# Altium schematic sheet PIC32MZ.SchDoc
size A3; SheetNumber: 3; SheetTotal: 8
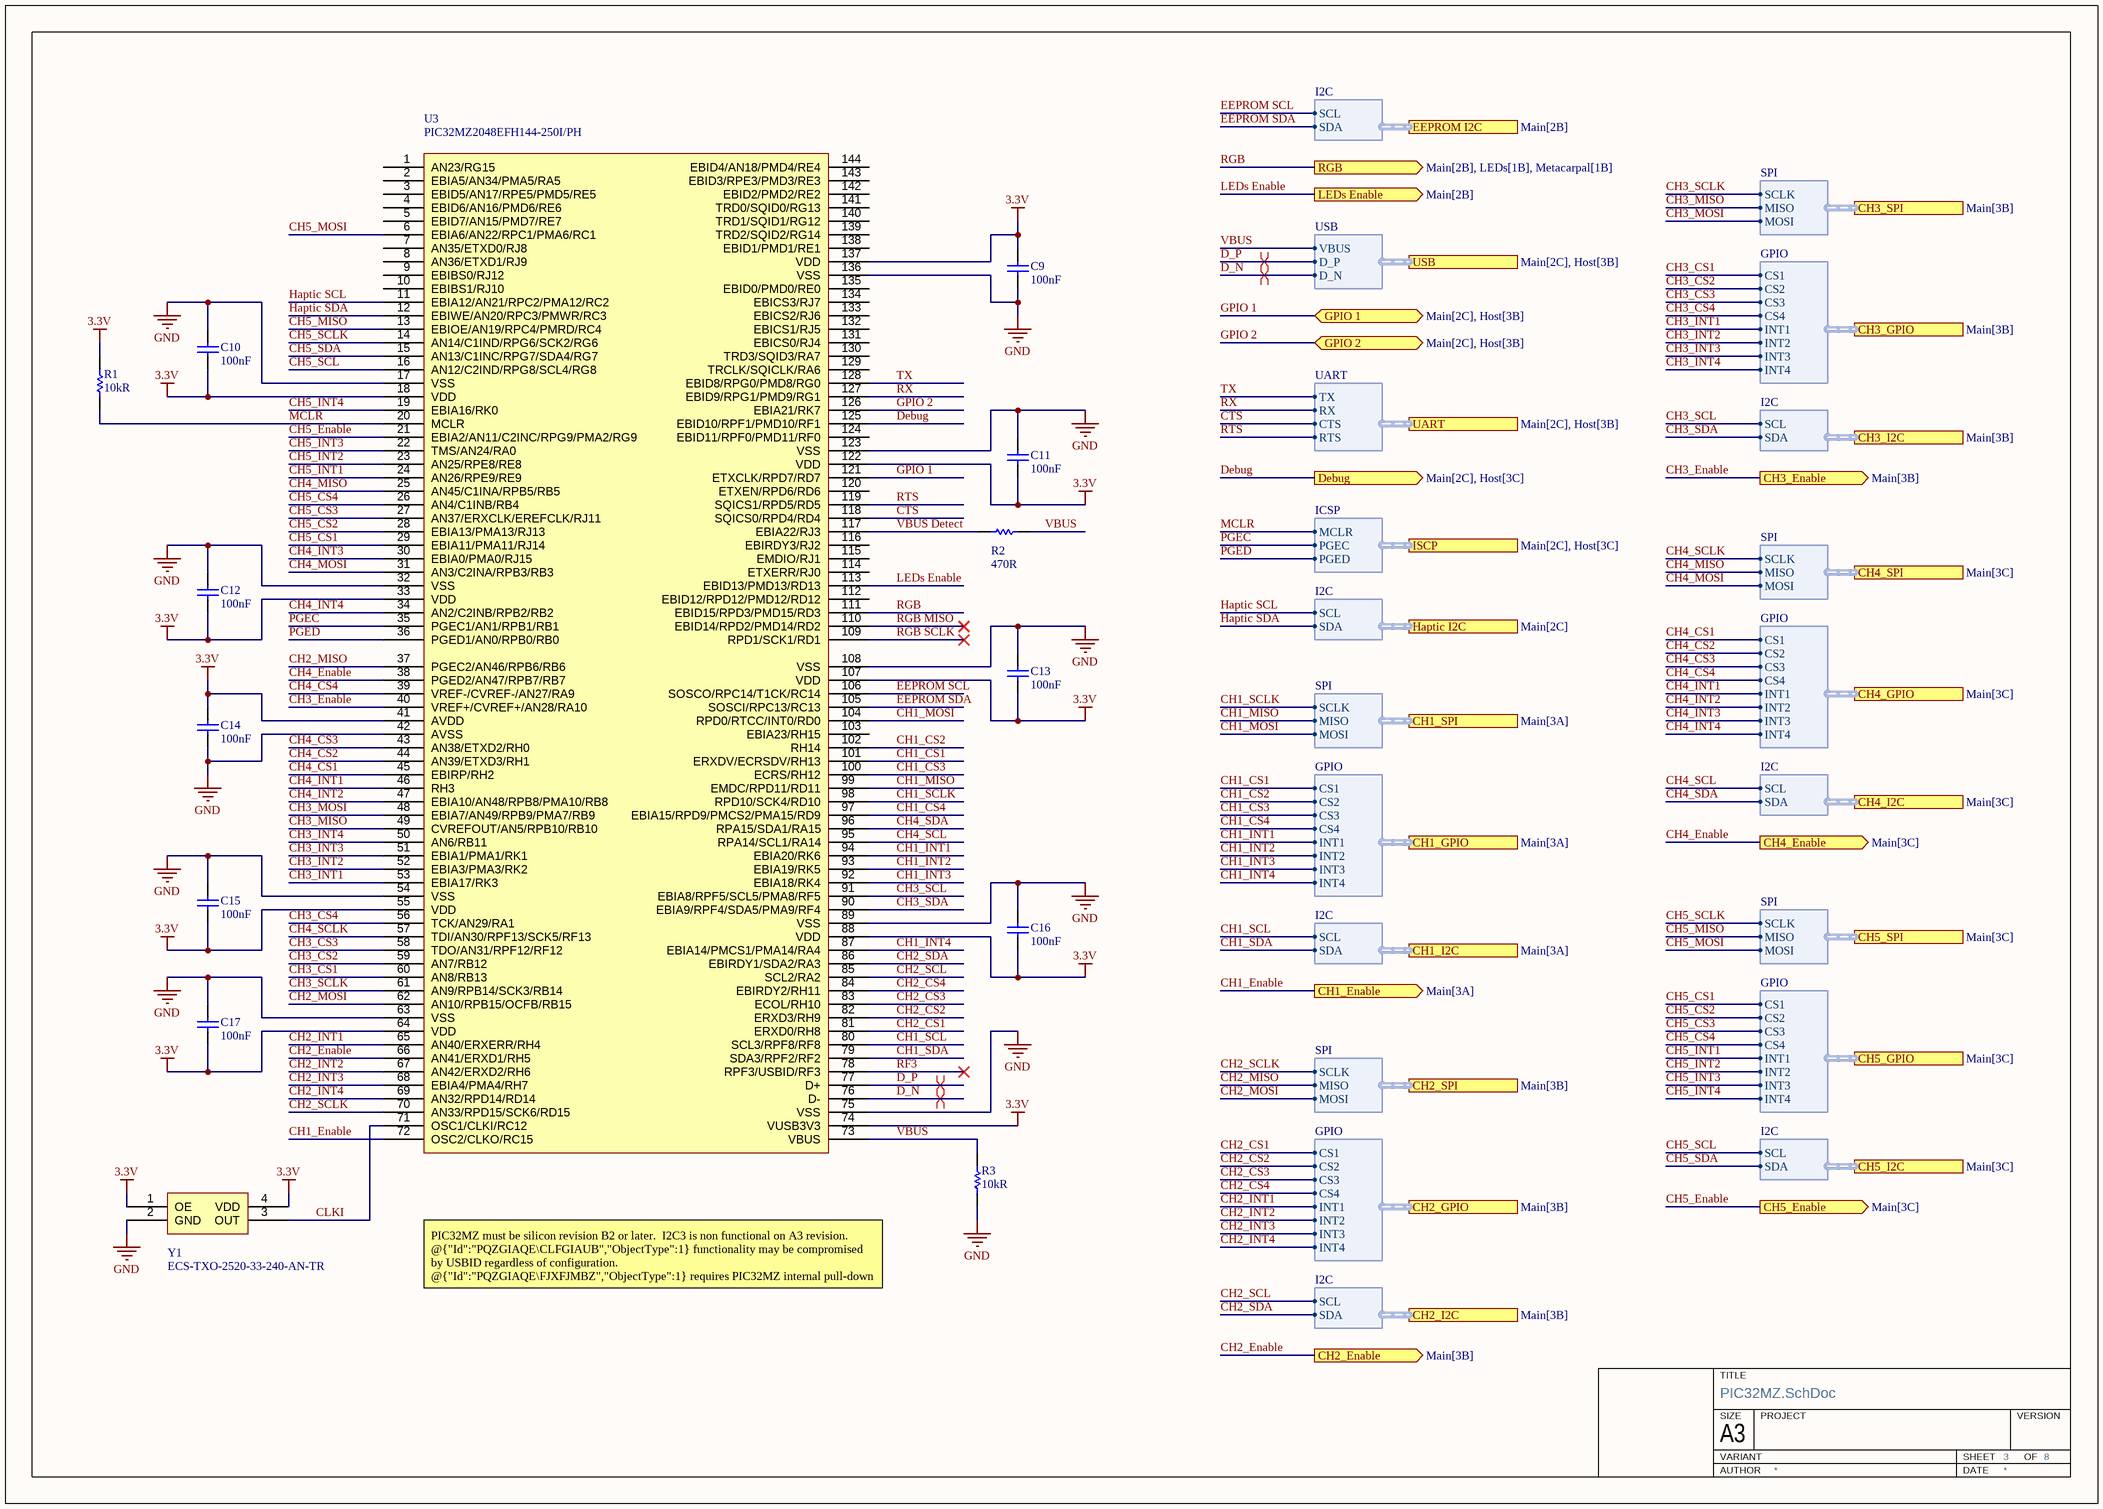
[diagram p0: PIC32MZ.SchDoc]

## Parts
C9  100nF  [Capacitor 0402]
C10  100nF  [Capacitor 0402]
C11  100nF  [Capacitor 0402]
C12  100nF  [Capacitor 0402]
C13  100nF  [Capacitor 0402]
C14  100nF  [Capacitor 0402]
C15  100nF  [Capacitor 0402]
C16  100nF  [Capacitor 0402]
C17  100nF  [Capacitor 0402]
R1  10kR  [Resistor 0402]
R2  470R  [Resistor 0402]
R3  10kR  [Resistor 0402]
U3  PIC32MZ2048EFH144-250I/PH  [TQFP-144 0.4mm]
Y1  ECS-TXO-2520-33-240-AN-TR  [ECS 2x2.5mm]

## Ports
CH1_Enable (out, see Main[3A]), CH1_GPIO (harness GPIO, see Main[3A]), CH1_I2C (harness I2C, see Main[3A]), CH1_SPI (harness SPI, see Main[3A]), CH2_Enable (out, see Main[3B]), CH2_GPIO (harness GPIO, see Main[3B]), CH2_I2C (harness I2C, see Main[3B]), CH2_SPI (harness SPI, see Main[3B]), CH3_Enable (out, see Main[3B]), CH3_GPIO (harness GPIO, see Main[3B]), CH3_I2C (harness I2C, see Main[3B]), CH3_SPI (harness SPI, see Main[3B]), CH4_Enable (out, see Main[3C]), CH4_GPIO (harness GPIO, see Main[3C]), CH4_I2C (harness I2C, see Main[3C]), CH4_SPI (harness SPI, see Main[3C]), CH5_Enable (out, see Main[3C]), CH5_GPIO (harness GPIO, see Main[3C]), CH5_I2C (harness I2C, see Main[3C]), CH5_SPI (harness SPI, see Main[3C]), Debug (out, see Main[2C], Host[3C]), EEPROM I2C (harness I2C, see Main[2B]), GPIO 1 (bidir, see Main[2C], Host[3B]), GPIO 2 (bidir, see Main[2C], Host[3B]), Haptic I2C (harness I2C, see Main[2C]), ISCP (harness ICSP, see Main[2C], Host[3C]), LEDs Enable (out, see Main[2B]), RGB (out, see Main[2B], LEDs[1B], Metacarpal[1B]), UART (harness UART, see Main[2C], Host[3B]), USB (harness USB, see Main[2C], Host[3B])

## Harnesses
I2C: SCL, SDA
SPI: SCLK, MISO, MOSI
GPIO: CS1, CS2, CS3, CS4, INT1, INT2, INT3, INT4
UART: TX, RX, CTS, RTS
USB: VBUS, D_P, D_N
ICSP: MCLR, PGEC, PGED

## Nets
3.3V: C9.2 C10.1 C11.1 C12.1 C13.1 C14.2 C15.1 C16.1 C17.1 R1.2 U3.18(VDD) U3.33(VDD) U3.41(AVDD) U3.55(VDD) U3.64(VDD) U3.74(VUSB3V3) U3.88(VDD) U3.107(VDD) U3.122(VDD) U3.137(VDD) Y1.1(OE) Y1.4(VDD)
GND: C9.1 C10.2 C11.2 C12.2 C13.2 C14.1 C15.2 C16.2 C17.2 R3.1 U3.17(VSS) U3.32(VSS) U3.42(AVSS) U3.54(VSS) U3.63(VSS) U3.75(VSS) U3.89(VSS) U3.108(VSS) U3.123(VSS) U3.136(VSS) Y1.2(GND)
CH1_CS1: U3.101(ERXDV/ECRSDV/RH13) ; port CH1_GPIO.CS1
CH1_CS2: U3.102(RH14) ; port CH1_GPIO.CS2
CH1_CS3: U3.100(ECRS/RH12) ; port CH1_GPIO.CS3
CH1_CS4: U3.97(EBIA15/RPD9/PMCS2/PMA15/RD9) ; port CH1_GPIO.CS4
CH1_Enable: U3.72(OSC2/CLKO/RC15) ; port CH1_Enable
CH1_INT1: U3.94(EBIA20/RK6) ; port CH1_GPIO.INT1
CH1_INT2: U3.93(EBIA19/RK5) ; port CH1_GPIO.INT2
CH1_INT3: U3.92(EBIA18/RK4) ; port CH1_GPIO.INT3
CH1_INT4: U3.87(EBIA14/PMCS1/PMA14/RA4) ; port CH1_GPIO.INT4
CH1_MISO: U3.99(EMDC/RPD11/RD11) ; port CH1_SPI.MISO
CH1_MOSI: U3.104(RPD0/RTCC/INT0/RD0) ; port CH1_SPI.MOSI
CH1_SCL: U3.80(SCL3/RPF8/RF8) ; port CH1_I2C.SCL
CH1_SCLK: U3.98(RPD10/SCK4/RD10) ; port CH1_SPI.SCLK
CH1_SDA: U3.79(SDA3/RPF2/RF2)
CH2_CS1: U3.81(ERXD0/RH8) ; port CH2_GPIO.CS1
CH2_CS2: U3.82(ERXD3/RH9) ; port CH2_GPIO.CS2
CH2_CS3: U3.83(ECOL/RH10) ; port CH2_GPIO.CS3
CH2_CS4: U3.84(EBIRDY2/RH11) ; port CH2_GPIO.CS4
CH2_Enable: U3.66(AN41/ERXD1/RH5) ; port CH2_Enable
CH2_INT1: U3.65(AN40/ERXERR/RH4) ; port CH2_GPIO.INT1
CH2_INT2: U3.67(AN42/ERXD2/RH6) ; port CH2_GPIO.INT2
CH2_INT3: U3.68(EBIA4/PMA4/RH7) ; port CH2_GPIO.INT3
CH2_INT4: U3.69(AN32/RPD14/RD14) ; port CH2_GPIO.INT4
CH2_MISO: U3.37(PGEC2/AN46/RPB6/RB6) ; port CH2_SPI.MISO
CH2_MOSI: U3.62(AN10/RPB15/OCFB/RB15) ; port CH2_SPI.MOSI
CH2_SCL: U3.85(SCL2/RA2) ; port CH2_I2C.SCL
CH2_SCLK: U3.70(AN33/RPD15/SCK6/RD15) ; port CH2_SPI.SCLK
CH2_SDA: U3.86(EBIRDY1/SDA2/RA3)
CH3_CS1: U3.60(AN8/RB13) ; port CH3_GPIO.CS1
CH3_CS2: U3.59(AN7/RB12) ; port CH3_GPIO.CS2
CH3_CS3: U3.58(TDO/AN31/RPF12/RF12) ; port CH3_GPIO.CS3
CH3_CS4: U3.56(TCK/AN29/RA1) ; port CH3_GPIO.CS4
CH3_Enable: U3.40(VREF+/CVREF+/AN28/RA10) ; port CH3_Enable
CH3_INT1: U3.53(EBIA17/RK3) ; port CH3_GPIO.INT1
CH3_INT2: U3.52(EBIA3/PMA3/RK2) ; port CH3_GPIO.INT2
CH3_INT3: U3.51(EBIA1/PMA1/RK1) ; port CH3_GPIO.INT3
CH3_INT4: U3.50(AN6/RB11) ; port CH3_GPIO.INT4
CH3_MISO: U3.49(CVREFOUT/AN5/RPB10/RB10) ; port CH3_SPI.MISO
CH3_MOSI: U3.48(EBIA7/AN49/RPB9/PMA7/RB9) ; port CH3_SPI.MOSI
CH3_SCL: U3.91(EBIA8/RPF5/SCL5/PMA8/RF5) ; port CH3_I2C.SCL
CH3_SCLK: U3.61(AN9/RPB14/SCK3/RB14) ; port CH3_SPI.SCLK
CH3_SDA: U3.90(EBIA9/RPF4/SDA5/PMA9/RF4)
CH4_CS1: U3.45(EBIRP/RH2) ; port CH4_GPIO.CS1
CH4_CS2: U3.44(AN39/ETXD3/RH1) ; port CH4_GPIO.CS2
CH4_CS3: U3.43(AN38/ETXD2/RH0) ; port CH4_GPIO.CS3
CH4_CS4: U3.39(VREF-/CVREF-/AN27/RA9) ; port CH4_GPIO.CS4
CH4_Enable: U3.38(PGED2/AN47/RPB7/RB7) ; port CH4_Enable
CH4_INT1: U3.46(RH3) ; port CH4_GPIO.INT1
CH4_INT2: U3.47(EBIA10/AN48/RPB8/PMA10/RB8) ; port CH4_GPIO.INT2
CH4_INT3: U3.30(EBIA0/PMA0/RJ15) ; port CH4_GPIO.INT3
CH4_INT4: U3.34(AN2/C2INB/RPB2/RB2) ; port CH4_GPIO.INT4
CH4_MISO: U3.25(AN45/C1INA/RPB5/RB5) ; port CH4_SPI.MISO
CH4_MOSI: U3.31(AN3/C2INA/RPB3/RB3) ; port CH4_SPI.MOSI
CH4_SCL: U3.95(RPA14/SCL1/RA14) ; port CH4_I2C.SCL
CH4_SCLK: U3.57(TDI/AN30/RPF13/SCK5/RF13) ; port CH4_SPI.SCLK
CH4_SDA: U3.96(RPA15/SDA1/RA15)
CH5_CS1: U3.29(EBIA11/PMA11/RJ14) ; port CH5_GPIO.CS1
CH5_CS2: U3.28(EBIA13/PMA13/RJ13) ; port CH5_GPIO.CS2
CH5_CS3: U3.27(AN37/ERXCLK/EREFCLK/RJ11) ; port CH5_GPIO.CS3
CH5_CS4: U3.26(AN4/C1INB/RB4) ; port CH5_GPIO.CS4
CH5_Enable: U3.21(EBIA2/AN11/C2INC/RPG9/PMA2/RG9) ; port CH5_Enable
CH5_INT1: U3.24(AN26/RPE9/RE9) ; port CH5_GPIO.INT1
CH5_INT2: U3.23(AN25/RPE8/RE8) ; port CH5_GPIO.INT2
CH5_INT3: U3.22(TMS/AN24/RA0) ; port CH5_GPIO.INT3
CH5_INT4: U3.19(EBIA16/RK0) ; port CH5_GPIO.INT4
CH5_MISO: U3.13(EBIOE/AN19/RPC4/PMRD/RC4) ; port CH5_SPI.MISO
CH5_MOSI: U3.6(EBIA6/AN22/RPC1/PMA6/RC1) ; port CH5_SPI.MOSI
CH5_SCL: U3.16(AN12/C2IND/RPG8/SCL4/RG8) ; port CH5_I2C.SCL
CH5_SCLK: U3.14(AN14/C1IND/RPG6/SCK2/RG6) ; port CH5_SPI.SCLK
CH5_SDA: U3.15(AN13/C1INC/RPG7/SDA4/RG7)
CLKI: U3.71(OSC1/CLKI/RC12) Y1.3(OUT)
CTS: U3.118(SQICS0/RPD4/RD4) ; port UART.CTS
D_N: U3.76(D-) ; port USB.D_N
D_P: U3.77(D+) ; port USB.D_P
Debug: U3.125(EBID10/RPF1/PMD10/RF1) ; port Debug
EEPROM SCL: U3.106(SOSCO/RPC14/T1CK/RC14) ; port EEPROM I2C.SCL
EEPROM SDA: U3.105(SOSCI/RPC13/RC13)
GPIO 1: U3.121(ETXCLK/RPD7/RD7) ; port GPIO 1
GPIO 2: U3.126(EBIA21/RK7) ; port GPIO 2
Haptic SCL: U3.11(EBIA12/AN21/RPC2/PMA12/RC2) ; port Haptic I2C.SCL
Haptic SDA: U3.12(EBIWE/AN20/RPC3/PMWR/RC3)
LEDs Enable: U3.113(EBID13/PMD13/RD13) ; port LEDs Enable
MCLR: R1.1 U3.20(MCLR) ; port ISCP.MCLR
PGEC: U3.35(PGEC1/AN1/RPB1/RB1) ; port ISCP.PGEC
PGED: U3.36(PGED1/AN0/RPB0/RB0) ; port ISCP.PGED
RF3: U3.78(RPF3/USBID/RF3)
RGB: U3.111(EBID15/RPD3/PMD15/RD3) ; port RGB
RGB MISO: U3.110(EBID14/RPD2/PMD14/RD2)
RGB SCLK: U3.109(RPD1/SCK1/RD1)
RTS: U3.119(SQICS1/RPD5/RD5) ; port UART.RTS
RX: U3.127(EBID9/RPG1/PMD9/RG1) ; port UART.RX
TX: U3.128(EBID8/RPG0/PMD8/RG0) ; port UART.TX
VBUS: R2.1 R3.2 U3.73(VBUS) ; port USB.VBUS
VBUS Detect: R2.2 U3.117(EBIA22/RJ3)

Not connected (* = marked no-connect by the designer): U3 1(AN23/RG15) 2(EBIA5/AN34/PMA5/RA5) 3(EBID5/AN17/RPE5/PMD5/RE5) 4(EBID6/AN16/PMD6/RE6) 5(EBID7/AN15/PMD7/RE7) 7(AN35/ETXD0/RJ8) 8(AN36/ETXD1/RJ9) 9(EBIBS0/RJ12) 10(EBIBS1/RJ10) 103(EBIA23/RH15) 112(EBID12/RPD12/PMD12/RD12) 114(ETXERR/RJ0) 115(EMDIO/RJ1) 116(EBIRDY3/RJ2) 120(ETXEN/RPD6/RD6) 124(EBID11/RPF0/PMD11/RF0) 129(TRCLK/SQICLK/RA6) 130(TRD3/SQID3/RA7) 131(EBICS0/RJ4) 132(EBICS1/RJ5) 133(EBICS2/RJ6) 134(EBICS3/RJ7) 135(EBID0/PMD0/RE0) 138(EBID1/PMD1/RE1) 139(TRD2/SQID2/RG14) 140(TRD1/SQID1/RG12) 141(TRD0/SQID0/RG13) 142(EBID2/PMD2/RE2) 143(EBID3/RPE3/PMD3/RE3) 144(EBID4/AN18/PMD4/RE4)

## Layout directives
differential pair: D_N, D_P

## Notes on the sheet
- PIC32MZ must be silicon revision B2 or later.  I2C3 is non functional on A3 revision.
  @{"Id":"PQZGIAQE\CLFGIAUB","ObjectType":1} functionality may be compromised by USBID regardless of configuration.
  @{"Id":"PQZGIAQE\FJXFJMBZ","ObjectType":1} requires PIC32MZ internal pull-down to ensure @{"Id":"QSPHDPUG\XVWCFEXP","ObjectType":1} is idle low.
  @{"Id":"PQZGIAQE\AZLPJNPW","ObjectType":1} will output SCK1 regardless of PPS configuration.
- TITLE
- SIZE
- A3
- VARIANT
- PROJECT
- SHEET
- VERSION
- OF
- AUTHOR
- DATE

## Library data of the parts
C9-C17 = Capacitor
R1-R3 = Resistor
Y1 = Oscillator